# EAGLE schematic PDUv1 (EAGLE 9.6.2)

## Sheet 1 of 4
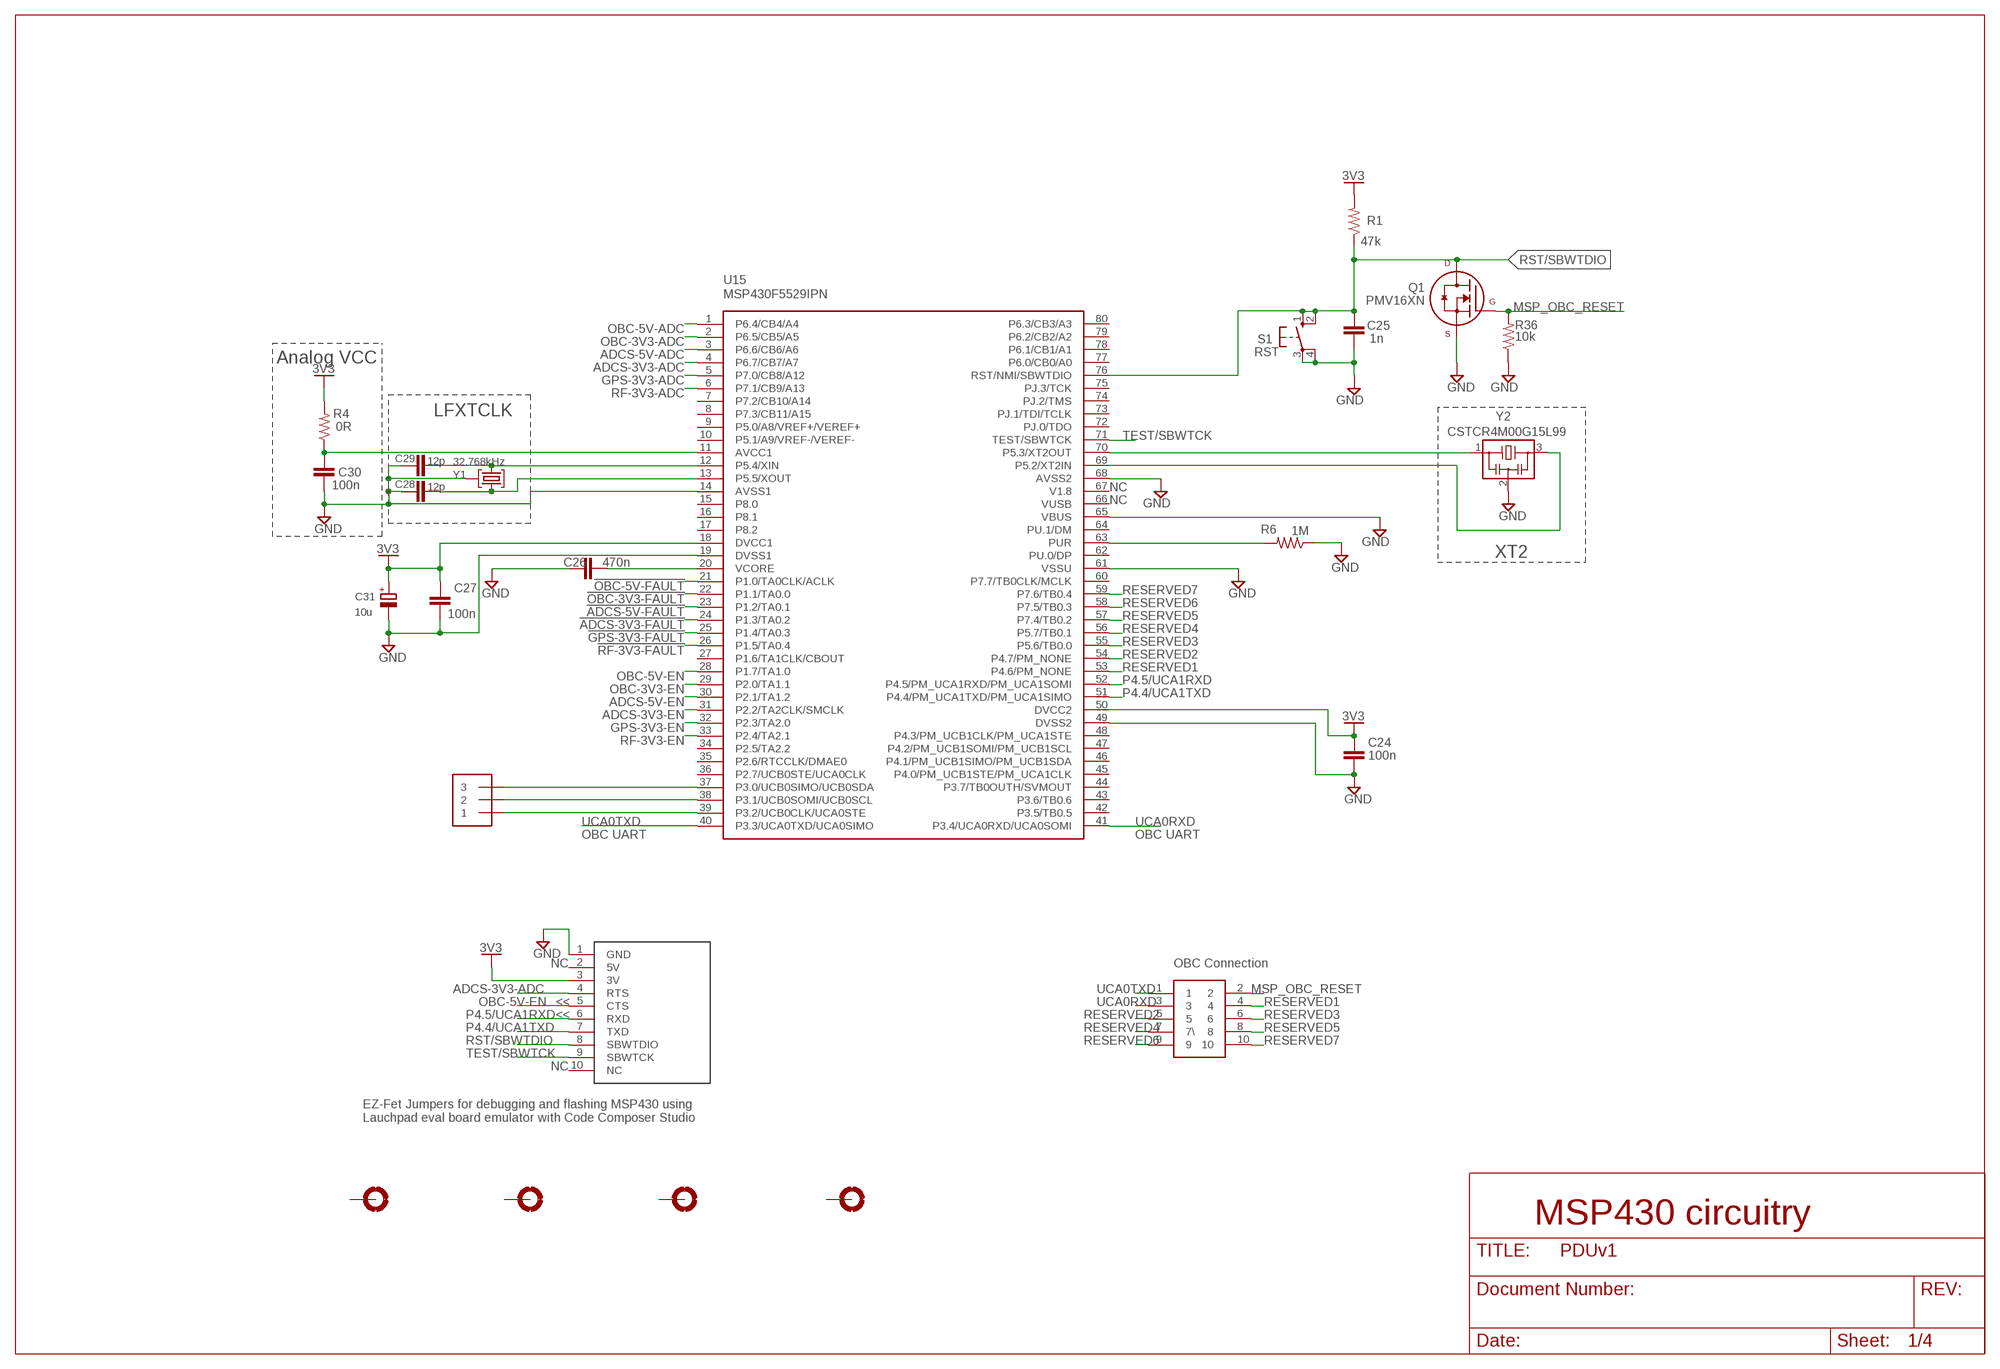
[diagram p0: schematic, sheet 1]

### Parts
C24  100n  C-EUC0402  [C0402]
C25  1n  C-EUC0402  [C0402]
C26  470n  C-EUC0402  [C0402]
C27  100n  C-EUC0402  [C0402]
C28  12p  C-EUC0402  [C0402]
C29  12p  C-EUC0402  [C0402]
C30  100n  C-EUC0402  [C0402]
C31  10u  POLARIZED_CAP  [A/3216-18R]
J5  HDR_10_EZFET_DEBUGGER  [HDRV10W66P254_10X1_2540X254H858]
MH1  MTGP700H400  [MTGP700H400]
MH2  MTGP700H400  [MTGP700H400]
MH3  MTGP700H400  [MTGP700H400]
MH4  MTGP700H400  [MTGP700H400]
Q1  PMV16XN  [SOT23-3P95_230X110L20X43N_PMV16XN]
R1  47k  R-US_R0402  [R0402]
R4  0R  R-US_R0402  [R0402]
R6  1M  R-US_R0603  [R0603]
R36  10k  R-US_R0603  [R0603]
S1  RST  10-XX  [B3F-10XX]
U15  MSP430F5529IPN  [QFP80P50_1400X1400X160L60X22N]
U$22  OBC-CONNECTOR  [OBC-CON]
U$23  GRPB031VWTC-RC  [GRPB031VWTC-RC]
Y1  32.768kHz  MS3V-T1R  [MS3V-T1R]
Y2  CSTCR4M00G15L99  CSTCR4M00G15L996M00G53Z  [MURATA-FILTER_CSTCR]

### Nets
3V3: C24.1 C27.2 C31.+ J5.3(3V) R1.2 R4.2 U15.18(DVCC1) U15.50(DVCC2) ; also sheet 4
!ADCS-3V3-FAULT: U15.24(P1.3/TA0.2) ; also sheet 4
!ADCS-5V-FAULT: U15.23(P1.2/TA0.1) ; also sheet 4
!GPS-3V3-FAULT: U15.25(P1.4/TA0.3) ; also sheet 4
!OBC-3V3-FAULT: U15.22(P1.1/TA0.0) ; also sheet 4
!OBC-5V-FAULT: U15.21(P1.0/TA0CLK/ACLK) ; also sheet 4
!RF-3V3-FAULT: U15.26(P1.5/TA0.4) ; also sheet 4
ADCS-3V3-ADC: J5.4(RTS) U15.4(P6.7/CB7/A7) ; also sheet 4
ADCS-3V3-EN: U15.31(P2.2/TA2CLK/SMCLK) ; also sheet 4
ADCS-5V-ADC: U15.3(P6.6/CB6/A6) ; also sheet 4
ADCS-5V-EN: U15.30(P2.1/TA1.2) ; also sheet 4
AVCC1 [Power]: C30.1 R4.1 U15.11(AVCC1)
GND: C24.2 C25.2 C26.1 C27.1 C28.1 C29.1 C30.2 C31.- J5.1(GND) Q1.2(S) R6.1 R36.1 S1.3(P) S1.4(P1) U15.14(AVSS1) U15.19(DVSS1) U15.49(DVSS2) U15.61(VSSU) U15.65(VBUS) U15.68(AVSS2) Y1.P3(GND) Y2.2 ; also sheet 2,3,4
GPS-3V3-ADC: U15.5(P7.0/CB8/A12) ; also sheet 4
GPS-3V3-EN: U15.32(P2.3/TA2.0) ; also sheet 4
MSP_OBC_RESET: Q1.1(G) R36.2 U$22.2
OBC-3V3-ADC: U15.2(P6.5/CB5/A5) ; also sheet 4
OBC-3V3-EN: U15.29(P2.0/TA1.1) ; also sheet 4
OBC-5V-ADC: U15.1(P6.4/CB4/A4) ; also sheet 4
OBC-5V-EN: J5.5(CTS) U15.28(P1.7/TA1.0) ; also sheet 4
P4.4/UCA1TXD: J5.7(TXD) U15.51(P4.4/PM_UCA1TXD/PM_UCA1SIMO)
P4.5/UCA1RXD: J5.6(RXD) U15.52(P4.5/PM_UCA1RXD/PM_UCA1SOMI)
P5.2/XT2IN1: U15.69(P5.2/XT2IN) Y2.3
P5.3/XT2OUT1: U15.70(P5.3/XT2OUT) Y2.1
P5.4/XIN1: C29.2 U15.12(P5.4/XIN) Y1.P2
P5.5/XOUT1: C28.2 U15.13(P5.5/XOUT) Y1.P1
RESERVED1: U15.53(P4.6/PM_NONE) U$22.4
RESERVED2: U15.54(P4.7/PM_NONE) U$22.5
RESERVED3: U15.55(P5.6/TB0.0) U$22.6
RESERVED4: U15.56(P5.7/TB0.1) U$22.7(7\)
RESERVED5: U15.57(P7.4/TB0.2) U$22.8
RESERVED6: U15.58(P7.5/TB0.3) U$22.9
RESERVED7: U15.59(P7.6/TB0.4) U$22.10
RF-3V3-ADC: U15.6(P7.1/CB9/A13) ; also sheet 4
RF-3V3-EN: U15.33(P2.4/TA2.1) ; also sheet 4
RST/SBWTDIO: C25.1 J5.8(SBWTDIO) Q1.3(D) R1.1 S1.1(S) S1.2(S1) U15.76(RST/NMI/SBWTDIO)
TARGET_PUR: R6.2 U15.63(PUR)
TEST/SBWTCK: J5.9(SBWTCK) U15.71(TEST/SBWTCK)
UCA0RXD: U15.41(P3.4/UCA0RXD/UCA0SOMI) U$22.3
UCA0TXD: U15.40(P3.3/UCA0TXD/UCA0SIMO) U$22.1
UCB0CLK: U15.39(P3.2/UCB0CLK/UCA0STE) U$23.1
UCB0SCL: U15.38(P3.1/UCB0SOMI/UCB0SCL) U$23.2
UCB0SDA: U15.37(P3.0/UCB0SIMO/UCB0SDA) U$23.3
VCORE1 [Power]: C26.2 U15.20(VCORE)
Unconnected: J5.2(5V) J5.10(NC) MH1.1(MOUNT) MH2.1(MOUNT) MH3.1(MOUNT) MH4.1(MOUNT) U15.7(P7.2/CB10/A14) U15.8(P7.3/CB11/A15) U15.9(P5.0/A8/VREF+/VEREF+) U15.10(P5.1/A9/VREF-/VEREF-) U15.15(P8.0) U15.16(P8.1) U15.17(P8.2) U15.27(P1.6/TA1CLK/CBOUT) U15.34(P2.5/TA2.2) U15.35(P2.6/RTCCLK/DMAE0) U15.36(P2.7/UCB0STE/UCA0CLK) U15.42(P3.5/TB0.5) U15.43(P3.6/TB0.6) U15.44(P3.7/TB0OUTH/SVMOUT) U15.45(P4.0/PM_UCB1STE/PM_UCA1CLK) U15.46(P4.1/PM_UCB1SIMO/PM_UCB1SDA) U15.47(P4.2/PM_UCB1SOMI/PM_UCB1SCL) U15.48(P4.3/PM_UCB1CLK/PM_UCA1STE) U15.60(P7.7/TB0CLK/MCLK) U15.62(PU.0/DP) U15.64(PU.1/DM) U15.66(VUSB) U15.67(V1.8) U15.72(PJ.0/TDO) U15.73(PJ.1/TDI/TCLK) U15.74(PJ.2/TMS) U15.75(PJ.3/TCK) U15.77(P6.0/CB0/A0) U15.78(P6.1/CB1/A1) U15.79(P6.2/CB2/A2) U15.80(P6.3/CB3/A3)

### Notes on the sheet
- Analog VCC
- LFXTCLK
- NC
- NC
- XT2
- OBC UART | OBC UART
- NC | OBC Connection
- <<
- <<
- NC
- EZ-Fet Jumpers for debugging and flashing MSP430 using 
  Lauchpad eval board emulator with Code Composer Studio
- MSP430 circuitry

## Sheet 2 of 4
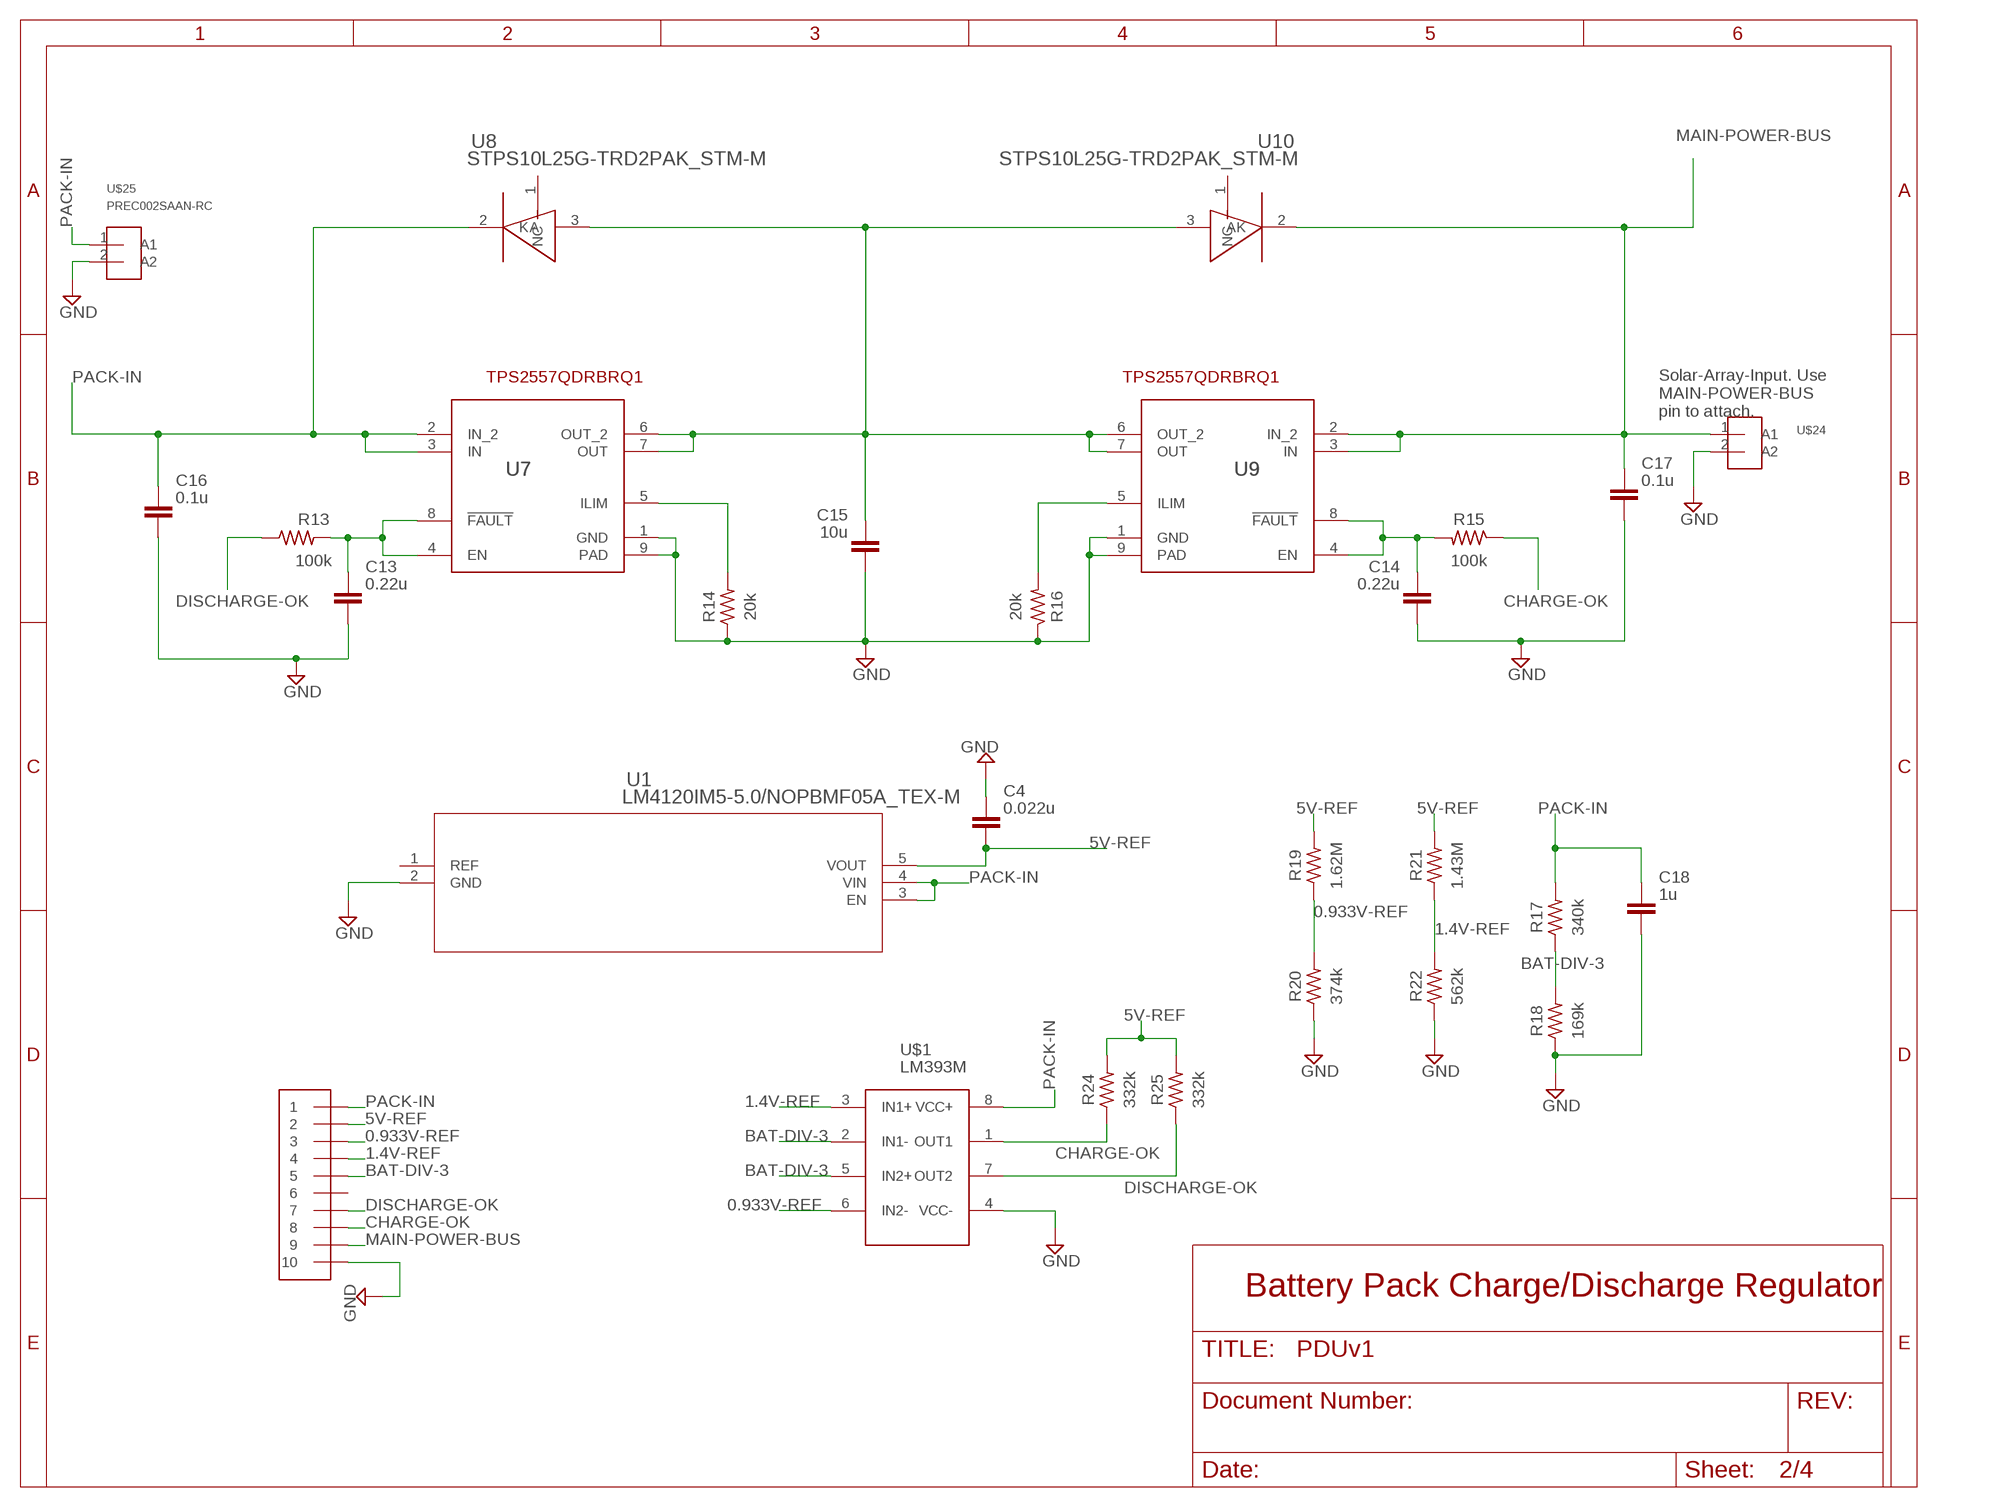
[diagram p1: schematic, sheet 2]

### Parts
C4  0.022u  C_CHIP-0603(1608-METRIC)  [CAPC1608X85]
C13  0.22u  C_CHIP-0603(1608-METRIC)  [CAPC1608X85]
C14  0.22u  C_CHIP-0603(1608-METRIC)  [CAPC1608X85]
C15  10u  C_CHIP-0603(1608-METRIC)  [CAPC1608X85]
C16  0.1u  C_CHIP-0603(1608-METRIC)  [CAPC1608X85]
C17  0.1u  C_CHIP-0603(1608-METRIC)  [CAPC1608X85]
C18  1u  C_CHIP-0603(1608-METRIC)  [CAPC1608X85]
R13  100k  R-US_CHIP-0603(1608-METRIC)  [RESC1608X60]
R14  20k  R-US_CHIP-0603(1608-METRIC)  [RESC1608X60]
R15  100k  R-US_CHIP-0603(1608-METRIC)  [RESC1608X60]
R16  20k  R-US_CHIP-0603(1608-METRIC)  [RESC1608X60]
R17  340k  R-US_CHIP-0603(1608-METRIC)  [RESC1608X60]
R18  169k  R-US_CHIP-0603(1608-METRIC)  [RESC1608X60]
R19  1.62M  R-US_CHIP-0603(1608-METRIC)  [RESC1608X60]
R20  374k  R-US_CHIP-0603(1608-METRIC)  [RESC1608X60]
R21  1.43M  R-US_CHIP-0603(1608-METRIC)  [RESC1608X60]
R22  562k  R-US_CHIP-0603(1608-METRIC)  [RESC1608X60]
R24  332k  R-US_CHIP-0603(1608-METRIC)  [RESC1608X60]
R25  332k  R-US_CHIP-0603(1608-METRIC)  [RESC1608X60]
U1  LM4120IM5-5.0/NOPBMF05A_TEX-M  [MF05A_TEX-M]
U7  Value  TPS2557QDRBRQ1  [DRB0008B]
U8  STPS10L25G-TRD2PAK_STM-M  [D2PAK_STM-M]
U9  Value  TPS2557QDRBRQ1  [DRB0008B]
U10  STPS10L25G-TRD2PAK_STM-M  [D2PAK_STM-M]
U$1  LM393M  [M08A-M]
U$20  GRPB052VWQS-RC  [GRPB052VWQS-RC]
U$24  PREC002SAAN-RC  [PREC002SAAN-RC]
U$25  PREC002SAAN-RC  [PREC002SAAN-RC]

### Nets
0.933V-REF: R19.1 R20.2 U$1.6(IN2-) U$20.3
1.4V-REF: R21.1 R22.2 U$1.3(IN1+) U$20.4
5V-REF: C4.2 R19.2 R21.2 R24.2 R25.2 U1.5(VOUT) U$20.2
BAT-DIV-3: R17.1 R18.2 U$1.2(IN1-) U$1.5(IN2+) U$20.5
CHARGE-OK: R15.1 R24.1 U$1.1(OUT1) U$20.8
DISCHARGE-OK: R13.1 R25.1 U$1.7(OUT2) U$20.7
GND: C4.1 C13.2 C14.2 C15.2 C16.2 C17.2 C18.2 R14.1 R16.1 R18.1 R20.1 R22.1 U1.2(GND) U7.1(GND) U7.9(PAD) U9.1(GND) U9.9(PAD) U$1.4(VCC-) U$20.10 U$24.2(A2) U$25.2(A2) ; also sheet 1,3,4
MAIN-POWER-BUS: C17.1 U9.2(IN_2) U9.3(IN) U10.2(K) U$20.9 U$24.1(A1) ; also sheet 3
N$3: C15.1 U7.6(OUT_2) U7.7(OUT) U8.3(A) U9.6(OUT_2) U9.7(OUT) U10.3(A)
N$15: C13.1 R13.2 U7.4(EN) U7.8(!FAULT)
N$18: R14.2 U7.5(ILIM)
N$19: C14.1 R15.2 U9.4(EN) U9.8(!FAULT)
N$21: R16.2 U9.5(ILIM)
PACK-IN: C16.1 C18.1 R17.2 U1.3(EN) U1.4(VIN) U7.2(IN_2) U7.3(IN) U8.2(K) U$1.8(VCC+) U$20.1 U$25.1(A1)
Unconnected: U1.1(REF) U8.1(NC) U10.1(NC) U$20.6

### Notes on the sheet
- Solar-Array-Input. Use 
  MAIN-POWER-BUS
  pin to attach.
- Battery Pack Charge/Discharge Regulator

## Sheet 3 of 4
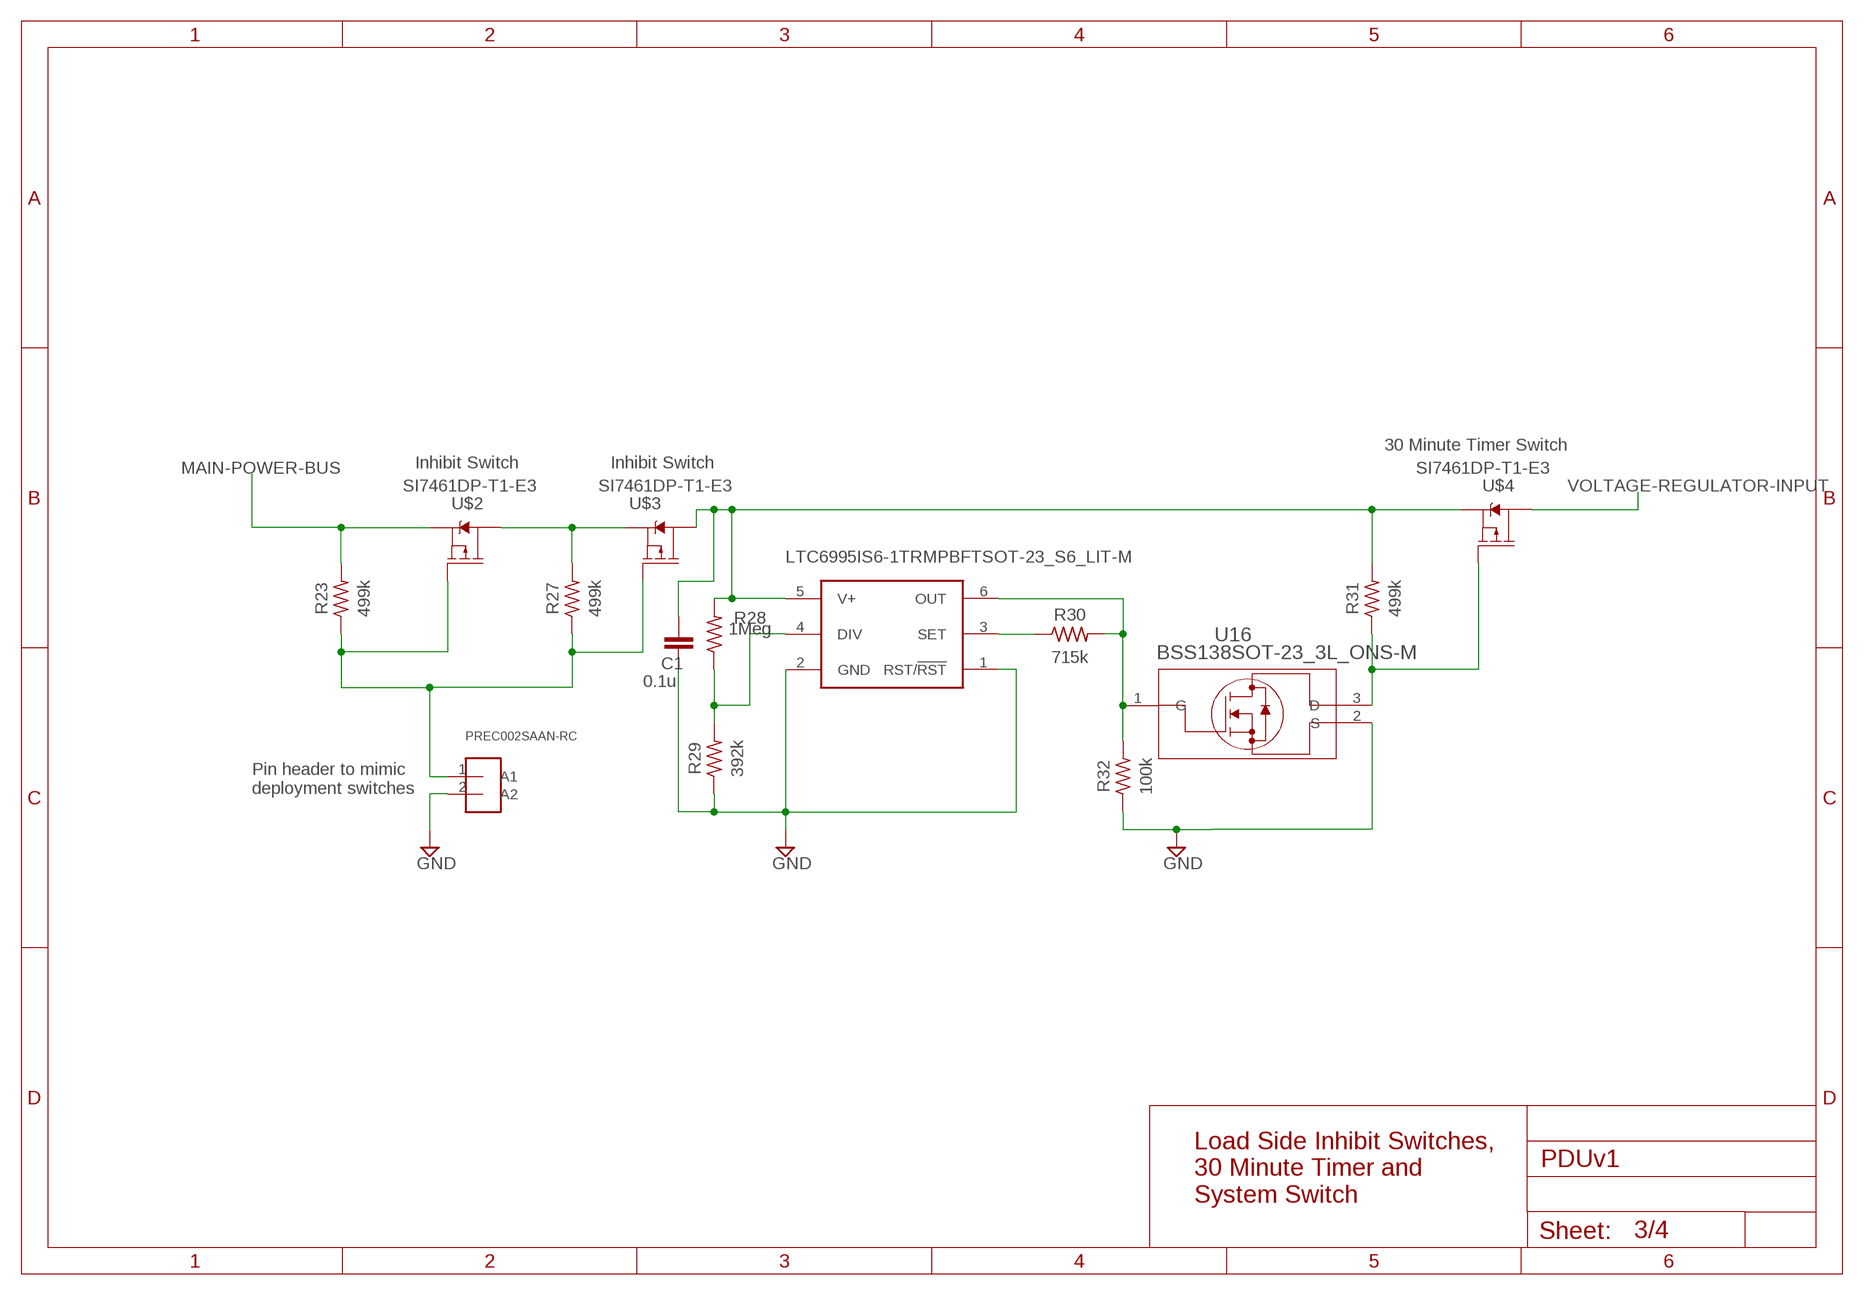
[diagram p2: schematic, sheet 3]

### Parts
C1  0.1u  C_CHIP-0603(1608-METRIC)  [CAPC1608X85]
R23  499k  R-US_CHIP-0603(1608-METRIC)  [RESC1608X60]
R27  499k  R-US_CHIP-0603(1608-METRIC)  [RESC1608X60]
R28  1Meg  R-US_CHIP-0603(1608-METRIC)  [RESC1608X60]
R29  392k  R-US_CHIP-0603(1608-METRIC)  [RESC1608X60]
R30  715k  R-US_CHIP-0603(1608-METRIC)  [RESC1608X60]
R31  499k  R-US_CHIP-0603(1608-METRIC)  [RESC1608X60]
R32  100k  R-US_CHIP-0603(1608-METRIC)  [RESC1608X60]
U12  LTC6995IS6-1TRMPBFTSOT-23_S6_LIT-M  [TSOT-23_S6_LIT-M]
U16  BSS138SOT-23_3L_ONS-M  [SOT-23_3L_ONS-M]
U$2  SI7461DP-T1-E3  [MOSFET_65DP-T1-E3_VIS]
U$3  SI7461DP-T1-E3  [MOSFET_65DP-T1-E3_VIS]
U$4  SI7461DP-T1-E3  [MOSFET_65DP-T1-E3_VIS]
U$7  PREC002SAAN-RC  [PREC002SAAN-RC]

### Nets
GND: C1.2 R29.1 R32.1 U12.1(RST/!RST) U12.2(GND) U16.2(S) U$7.2(A2) ; also sheet 1,2,4
MAIN-POWER-BUS: R23.2 U$2.1(S) U$2.2(S) U$2.3(S) ; also sheet 2
N$2: R31.1 U16.3(D) U$4.4(G)
N$4: R23.1 R27.1 U$2.4(G) U$3.4(G) U$7.1(A1)
N$17: C1.1 R28.2 R31.2 U12.5(V+) U$3.5(D) U$3.6(D) U$3.7(D) U$3.8(D) U$4.1(S) U$4.2(S) U$4.3(S)
N$22: R27.2 U$2.5(D) U$2.6(D) U$2.7(D) U$2.8(D) U$3.1(S) U$3.2(S) U$3.3(S)
N$24: R28.1 R29.2 U12.4(DIV)
N$25: R30.1 U12.3(SET)
N$26: R30.2 R32.2 U12.6(OUT) U16.1(G)
VOLTAGE-REGULATOR-INPUT: U$4.5(D) U$4.6(D) U$4.7(D) U$4.8(D) ; also sheet 4

### Notes on the sheet
- 30 Minute Timer Switch
- Inhibit Switch | Inhibit Switch
- Pin header to mimic
  deployment switches
- Load Side Inhibit Switches, 
  30 Minute Timer and 
  System Switch

## Sheet 4 of 4
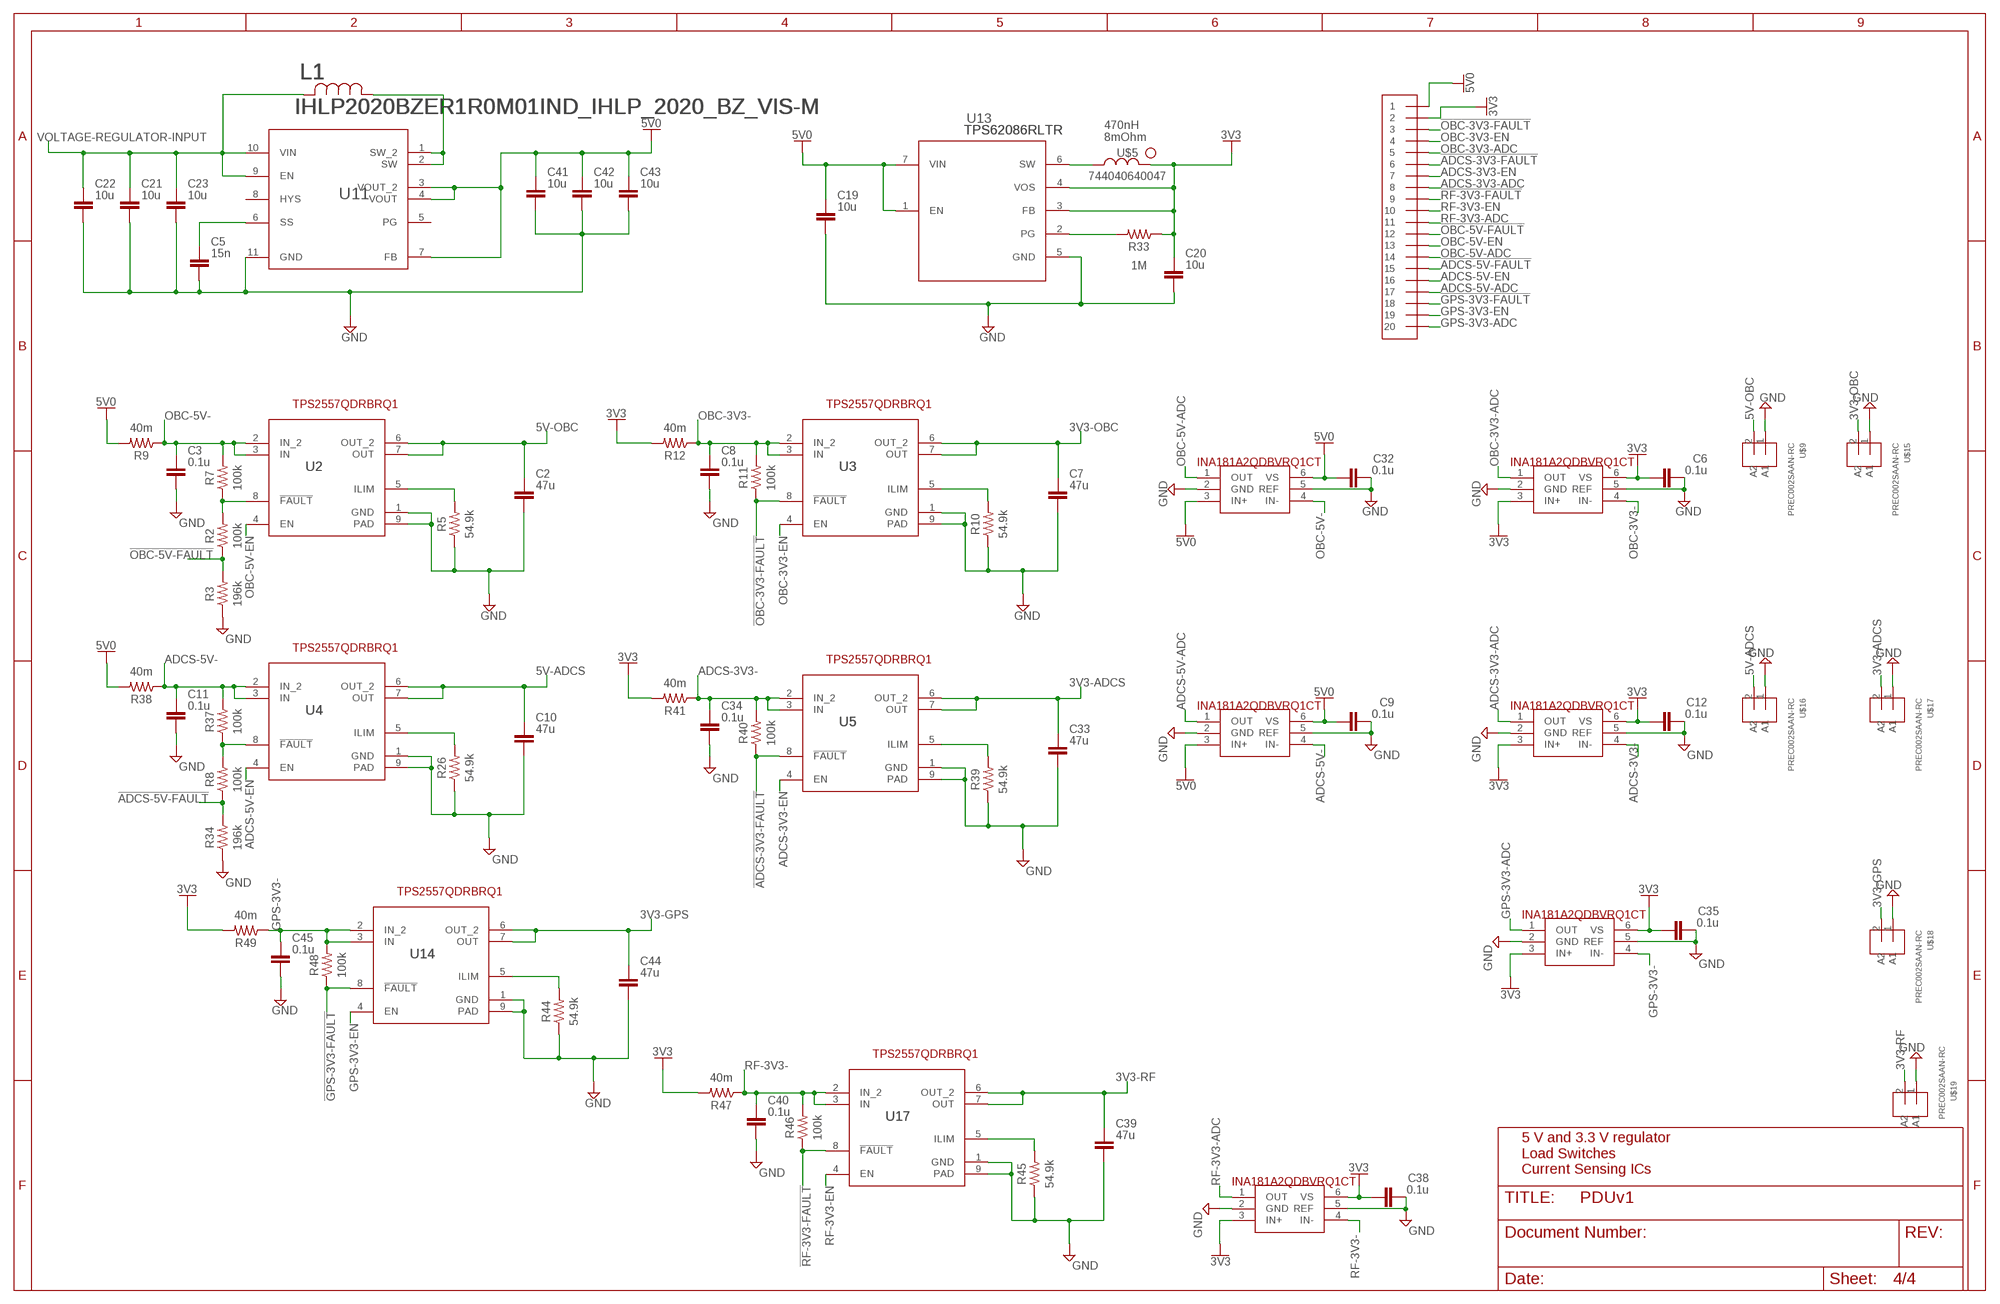
[diagram p3: schematic, sheet 4]

### Parts
C2  47u  C_CHIP-0603(1608-METRIC)  [CAPC1608X85]
C3  0.1u  C_CHIP-0603(1608-METRIC)  [CAPC1608X85]
C5  15n  C_CHIP-0603(1608-METRIC)  [CAPC1608X85]
C6  0.1u  C_CHIP-0603(1608-METRIC)  [CAPC1608X85]
C7  47u  C_CHIP-0603(1608-METRIC)  [CAPC1608X85]
C8  0.1u  C_CHIP-0603(1608-METRIC)  [CAPC1608X85]
C9  0.1u  C_CHIP-0603(1608-METRIC)  [CAPC1608X85]
C10  47u  C_CHIP-0603(1608-METRIC)  [CAPC1608X85]
C11  0.1u  C_CHIP-0603(1608-METRIC)  [CAPC1608X85]
C12  0.1u  C_CHIP-0603(1608-METRIC)  [CAPC1608X85]
C19  10u  C_CHIP-0603(1608-METRIC)  [CAPC1608X85]
C20  10u  C_CHIP-0603(1608-METRIC)  [CAPC1608X85]
C21  10u  C_CHIP-0603(1608-METRIC)  [CAPC1608X85]
C22  10u  C_CHIP-0603(1608-METRIC)  [CAPC1608X85]
C23  10u  C_CHIP-0603(1608-METRIC)  [CAPC1608X85]
C32  0.1u  C_CHIP-0603(1608-METRIC)  [CAPC1608X85]
C33  47u  C_CHIP-0603(1608-METRIC)  [CAPC1608X85]
C34  0.1u  C_CHIP-0603(1608-METRIC)  [CAPC1608X85]
C35  0.1u  C_CHIP-0603(1608-METRIC)  [CAPC1608X85]
C38  0.1u  C_CHIP-0603(1608-METRIC)  [CAPC1608X85]
C39  47u  C_CHIP-0603(1608-METRIC)  [CAPC1608X85]
C40  0.1u  C_CHIP-0603(1608-METRIC)  [CAPC1608X85]
C41  10u  C_CHIP-0603(1608-METRIC)  [CAPC1608X85]
C42  10u  C_CHIP-0603(1608-METRIC)  [CAPC1608X85]
C43  10u  C_CHIP-0603(1608-METRIC)  [CAPC1608X85]
C44  47u  C_CHIP-0603(1608-METRIC)  [CAPC1608X85]
C45  0.1u  C_CHIP-0603(1608-METRIC)  [CAPC1608X85]
L1  IHLP2020BZER1R0M01IND_IHLP_2020_BZ_VIS-M  [IND_IHLP_2020_BZ_VIS-M]
R2  100k  R-US_CHIP-0603(1608-METRIC)  [RESC1608X60]
R3  196k  R-US_CHIP-0603(1608-METRIC)  [RESC1608X60]
R5  54.9k  R-US_CHIP-0603(1608-METRIC)  [RESC1608X60]
R7  100k  R-US_CHIP-0603(1608-METRIC)  [RESC1608X60]
R8  100k  R-US_CHIP-0603(1608-METRIC)  [RESC1608X60]
R9  40m  R-US_CHIP-0603(1608-METRIC)  [RESC1608X60]
R10  54.9k  R-US_CHIP-0603(1608-METRIC)  [RESC1608X60]
R11  100k  R-US_CHIP-0603(1608-METRIC)  [RESC1608X60]
R12  40m  R-US_CHIP-0603(1608-METRIC)  [RESC1608X60]
R26  54.9k  R-US_CHIP-0603(1608-METRIC)  [RESC1608X60]
R33  1M  R-US_CHIP-0603(1608-METRIC)  [RESC1608X60]
R34  196k  R-US_CHIP-0603(1608-METRIC)  [RESC1608X60]
R37  100k  R-US_CHIP-0603(1608-METRIC)  [RESC1608X60]
R38  40m  R-US_CHIP-0603(1608-METRIC)  [RESC1608X60]
R39  54.9k  R-US_CHIP-0603(1608-METRIC)  [RESC1608X60]
R40  100k  R-US_CHIP-0603(1608-METRIC)  [RESC1608X60]
R41  40m  R-US_CHIP-0603(1608-METRIC)  [RESC1608X60]
R44  54.9k  R-US_CHIP-0603(1608-METRIC)  [RESC1608X60]
R45  54.9k  R-US_CHIP-0603(1608-METRIC)  [RESC1608X60]
R46  100k  R-US_CHIP-0603(1608-METRIC)  [RESC1608X60]
R47  40m  R-US_CHIP-0603(1608-METRIC)  [RESC1608X60]
R48  100k  R-US_CHIP-0603(1608-METRIC)  [RESC1608X60]
R49  40m  R-US_CHIP-0603(1608-METRIC)  [RESC1608X60]
U2  Value  TPS2557QDRBRQ1  [DRB0008B]
U3  Value  TPS2557QDRBRQ1  [DRB0008B]
U4  Value  TPS2557QDRBRQ1  [DRB0008B]
U5  Value  TPS2557QDRBRQ1  [DRB0008B]
U11  TPS61232DRCT  [DRC0010G]
U13  TPS62086RLTR  [RLT0007A]
U14  Value  TPS2557QDRBRQ1  [DRB0008B]
U17  Value  TPS2557QDRBRQ1  [DRB0008B]
U$5  744040640047  [744040640047]
U$8  INA181A2QDBVRQ1CT  INA181A2QDBVRQ1C  [TSOT-23_S6_LIT-M]
U$9  PREC002SAAN-RC  [PREC002SAAN-RC]
U$10  INA181A2QDBVRQ1CT  INA181A2QDBVRQ1C  [TSOT-23_S6_LIT-M]
U$11  INA181A2QDBVRQ1CT  INA181A2QDBVRQ1C  [TSOT-23_S6_LIT-M]
U$12  INA181A2QDBVRQ1CT  INA181A2QDBVRQ1C  [TSOT-23_S6_LIT-M]
U$13  INA181A2QDBVRQ1CT  INA181A2QDBVRQ1C  [TSOT-23_S6_LIT-M]
U$14  INA181A2QDBVRQ1CT  INA181A2QDBVRQ1C  [TSOT-23_S6_LIT-M]
U$15  PREC002SAAN-RC  [PREC002SAAN-RC]
U$16  PREC002SAAN-RC  [PREC002SAAN-RC]
U$17  PREC002SAAN-RC  [PREC002SAAN-RC]
U$18  PREC002SAAN-RC  [PREC002SAAN-RC]
U$19  PREC002SAAN-RC  [PREC002SAAN-RC]
U$21  GRPB102VWQS-RC  [GRPB102VWQS-RC]

### Nets
3V3: C6.1 C12.1 C20.1 C35.1 C38.1 R12.2 R33.1 R41.2 R47.2 R49.2 U13.3(FB) U13.4(VOS) U$5.1(DOT) U$10.3(IN+) U$10.6(VS) U$12.3(IN+) U$12.6(VS) U$13.3(IN+) U$13.6(VS) U$14.3(IN+) U$14.6(VS) U$21.2 ; also sheet 1
3V3-ADCS: C33.1 U5.6(OUT_2) U5.7(OUT) U$17.2(A2)
3V3-GPS: C44.1 U14.6(OUT_2) U14.7(OUT) U$18.2(A2)
3V3-OBC: C7.1 U3.6(OUT_2) U3.7(OUT) U$15.2(A2)
3V3-RF: C39.1 U17.6(OUT_2) U17.7(OUT) U$19.2(A2)
5V0: C9.1 C19.1 C32.1 C41.1 C42.1 C43.1 R9.2 R38.2 U11.3(VOUT_2) U11.4(VOUT) U11.7(FB) U13.1(EN) U13.7(VIN) U$8.3(IN+) U$8.6(VS) U$11.3(IN+) U$11.6(VS) U$21.1
5V-ADCS: C10.1 U4.6(OUT_2) U4.7(OUT) U$16.2(A2)
5V-OBC: C2.1 U2.6(OUT_2) U2.7(OUT) U$9.2(A2)
!ADCS-3V3-FAULT: R40.1 U5.8(!FAULT) U$21.6 ; also sheet 1
!ADCS-5V-FAULT: R8.1 R34.2 U$21.15 ; also sheet 1
!GPS-3V3-FAULT: R48.1 U14.8(!FAULT) U$21.18 ; also sheet 1
!OBC-3V3-FAULT: R11.1 U3.8(!FAULT) U$21.3 ; also sheet 1
!OBC-5V-FAULT: R2.1 R3.2 U$21.12 ; also sheet 1
!RF-3V3-FAULT: R46.1 U17.8(!FAULT) U$21.9 ; also sheet 1
ADCS-3V3-: C34.1 R40.2 R41.1 U5.2(IN_2) U5.3(IN) U$12.4(IN-)
ADCS-3V3-ADC: U$12.1(OUT) U$21.8 ; also sheet 1
ADCS-3V3-EN: U5.4(EN) U$21.7 ; also sheet 1
ADCS-5V-: C11.1 R37.2 R38.1 U4.2(IN_2) U4.3(IN) U$11.4(IN-)
ADCS-5V-ADC: U$11.1(OUT) U$21.17 ; also sheet 1
ADCS-5V-EN: U4.4(EN) U$21.16 ; also sheet 1
GND: C2.2 C3.2 C5.2 C6.2 C7.2 C8.2 C9.2 C10.2 C11.2 C12.2 C19.2 C20.2 C21.2 C22.2 C23.2 C32.2 C33.2 C34.2 C35.2 C38.2 C39.2 C40.2 C41.2 C42.2 C43.2 C44.2 C45.2 R3.1 R5.1 R10.1 R26.1 R34.1 R39.1 R44.1 R45.1 U2.1(GND) U2.9(PAD) U3.1(GND) U3.9(PAD) U4.1(GND) U4.9(PAD) U5.1(GND) U5.9(PAD) U11.11(GND) U13.5(GND) U14.1(GND) U14.9(PAD) U17.1(GND) U17.9(PAD) U$8.2(GND) U$8.5(REF) U$9.1(A1) U$10.2(GND) U$10.5(REF) U$11.2(GND) U$11.5(REF) U$12.2(GND) U$12.5(REF) U$13.2(GND) U$13.5(REF) U$14.2(GND) U$14.5(REF) U$15.1(A1) U$16.1(A1) U$17.1(A1) U$18.1(A1) U$19.1(A1) ; also sheet 1,2,3
GPS-3V3-: C45.1 R48.2 R49.1 U14.2(IN_2) U14.3(IN) U$13.4(IN-)
GPS-3V3-ADC: U$13.1(OUT) U$21.20 ; also sheet 1
GPS-3V3-EN: U14.4(EN) U$21.19 ; also sheet 1
N$1: R5.2 U2.5(ILIM)
N$5: R10.2 U3.5(ILIM)
N$6: R26.2 U4.5(ILIM)
N$7: R39.2 U5.5(ILIM)
N$9: R45.2 U17.5(ILIM)
N$10: R2.2 R7.1 U2.8(!FAULT)
N$11: R8.2 R37.1 U4.8(!FAULT)
N$12: L1.1 U11.1(SW_2) U11.2(SW)
N$13: C5.1 U11.6(SS)
N$14: R44.2 U14.5(ILIM)
N$30: U13.6(SW) U$5.2
N$31: R33.2 U13.2(PG)
OBC-3V3-: C8.1 R11.2 R12.1 U3.2(IN_2) U3.3(IN) U$10.4(IN-)
OBC-3V3-ADC: U$10.1(OUT) U$21.5 ; also sheet 1
OBC-3V3-EN: U3.4(EN) U$21.4 ; also sheet 1
OBC-5V-: C3.1 R7.2 R9.1 U2.2(IN_2) U2.3(IN) U$8.4(IN-)
OBC-5V-ADC: U$8.1(OUT) U$21.14 ; also sheet 1
OBC-5V-EN: U2.4(EN) U$21.13 ; also sheet 1
RF-3V3-: C40.1 R46.2 R47.1 U17.2(IN_2) U17.3(IN) U$14.4(IN-)
RF-3V3-ADC: U$14.1(OUT) U$21.11 ; also sheet 1
RF-3V3-EN: U17.4(EN) U$21.10 ; also sheet 1
VOLTAGE-REGULATOR-INPUT: C21.1 C22.1 C23.1 L1.2 U11.9(EN) U11.10(VIN) ; also sheet 3
Unconnected: U11.5(PG) U11.8(HYS)

### Notes on the sheet
- 470nH
  8mOhm
- 5 V and 3.3 V regulator
  Load Switches
  Current Sensing ICs

## Library data of the parts
C1-C23 C32-C35 C38-C45 = Capacitor:C: Capacitor - Generic; CATEGORY: Capacitor
C24-C30 = rcl:C-EU: CAPACITOR, European symbol; SPICEPREFIX: C
C31 = my_library:POLARIZED_CAP
J5 = my_library:HDR_10_EZFET_DEBUGGER
L1 = PDUv1:IHLP2020BZER1R0M01; BUILT_BY: EMA_UL_Team; MANUFACTURER_PART_NUMBER: IHLP2020BZER1R0M01; SOURCELIBRARY: Vishay_2020-02-10; VENDOR: Vishay
MH1-MH4 = my_library:MTGP700H400
Q1 = my_library:PMV16XN
R1 R4 R6 R36 = rcl:R-US_: RESISTOR, American symbol; SPICEPREFIX: R
R2 R3 R5 R7-R34 R37-R41 R44-R49 = Resistor:R-US: Resistor Fixed - ANSI; CATEGORY: Resistor; SUB-CATEGORY: Fixed
S1 = my_library:10-XX: OMRON SWITCH; MPN: B3F-1000; OC_FARNELL: 176432; OC_NEWARK: 36M3542
U1 = PDUv1:LM4120IM5-5.0/NOPB; BUILT_BY: EMA_UL_Team; COPYRIGHT: Copyright (C) 2018 Accelerated Designs. All rights reserved; MANUFACTURER_PART_NUMBER: LM4120IM5-5.0/NOPB; SOURCELIBRARY: National_2011-10-27; VENDOR: Texas Instruments
U2-U5 U7 U9 U14 U17 = PDUv1:TPS2557QDRBRQ1; MANUFACTURER: Texas Instruments; PARTNUMBER: TPS2557QDRBRQ1; REFDES: RefDes; TYPE: TYPE
U8 U10 = PDUv1:STPS10L25G-TR; BUILT_BY: EMA_UL_Team; MANUFACTURER_PART_NUMBER: STPS10L25G-TR; SOURCELIBRARY: StMicro_2015-03-30; VENDOR: STMicroelectronics
U11 = PDUv1:TPS61232DRCT; ADDRESS1: Not shown in title block; ADDRESS2: Not shown in title block; ADDRESS3: Not shown in title block; ADDRESS4: Not shown in title block; ALTERNATE_MANUFACTURER: None; APPROVEDBY: Not shown in title block; AUTHOR: Not shown in title block; CHECKEDBY: Not shown in title block; COMPANYNAME: Not shown in title block; COMPONENTLINK1DESCRIPTION: Datasheet Link; COMPONENTLINK1URL: https://sps06.itg.ti.com/sites/KMS/crossdivteams/altium/docs/ComponentDatasheets/TPS61230_SLVSAQ2_Jan 2014_preliminary.pdf; COMPTYPE: IC; CURRENTDATE: Not shown in title block; CURRENTTIME: Not shown in title block; DATE: Not shown in title block; DESIGNATOR: U?; DOCUMENTFULLPATHANDNAME: Not shown in title block; DOCUMENTNAME: Not shown in title block; DOCUMENTNUMBER: 1; ENGINEER: Not shown in title block; IMAGEPATH: Not shown in title block; LATESTREVISIONDATE: 2014-03-12; MANUFACTURER: Texas Instruments; MODIFIEDDATE: Not shown in title block; MOUNTTYPE: SMT; ORGANIZATION: Not shown in title block; PACKAGEREFERENCE: DRC0010G; PARTNUMBER: TPS61232DRC; PIN_COUNT: 11; PROJECTNAME: *; PUBLISHER: Texas Instruments; REVISION: Use project parameter SCH_Rev; ROHS: Y; RULE: *; SHEETNUMBER: 1; SHEETTOTAL: 1; SYMBOLCREATOR: a0411947; SYMBOLVERSION: 2014-03-05; TIME: Not shown in title block; U-M: EA
U12 = PDUv1:LTC6995IS6-1TRMPBF; BUILT_BY: EMA_UL_Team; MANUFACTURER_PART_NUMBER: LTC6995IS6-1#TRMPBF; SOURCELIBRARY: LinearTech_2016-05-13_6; VENDOR: Linear Technology
U13 = PDUv1:TPS62086RLTR; COMPTYPE: IC; MANUFACTURER: Texas Instruments; MOUNTTYPE: SMT; PACKAGEREFERENCE: RLT0007A; PARTNUMBER: TPS62086RLTR; PIN_COUNT: 7; REFDES: RefDes; ROHS: Y; TYPE: TYPE
U15 = my_library:MSP430F5529IPN
U16 = PDUv1:BSS138; BUILT_BY: EMA_Justin; COPYRIGHT: Copyright (C) 2018 Accelerated Designs. All rights reserved; DATASHEET: https://www.onsemi.com/pub/Collateral/BSS138-D.PDF; MANUFACTURER_PART_NUMBER: BSS138; SOURCELIBRARY: ON_Semiconductor_2020-01-13; VENDOR: ON Semiconductor
U$1 = PDUv1:LM393M
U$2-U$4 = PDUv1:SI7461DP-T1-E3
U$5 = PDUv1:744040640047
U$7 U$9 U$15-U$19 U$24 U$25 = PDUv1:PREC002SAAN-RC
U$8 U$10-U$14 = PDUv1:INA181A2QDBVRQ1C
U$20 = PDUv1:GRPB052VWQS-RC
U$21 = PDUv1:GRPB102VWQS-RC
U$22 = PDUv1:OBC-CONNECTOR
U$23 = PDUv1:GRPB031VWTC-RC
Y1 = my_library:MS3V-T1R
Y2 = my_library:CSTCR4M00G15L99; MPN: CSTCR6M00G53-R0; OC_FARNELL: 1170434; OC_NEWARK: 25M8759

## Net classes
2 Power: width 0.203 mm, drill 0.305 mm, clearance 0.152 mm to class 0, clearance 0.152 mm to class 1, clearance 0.152 mm